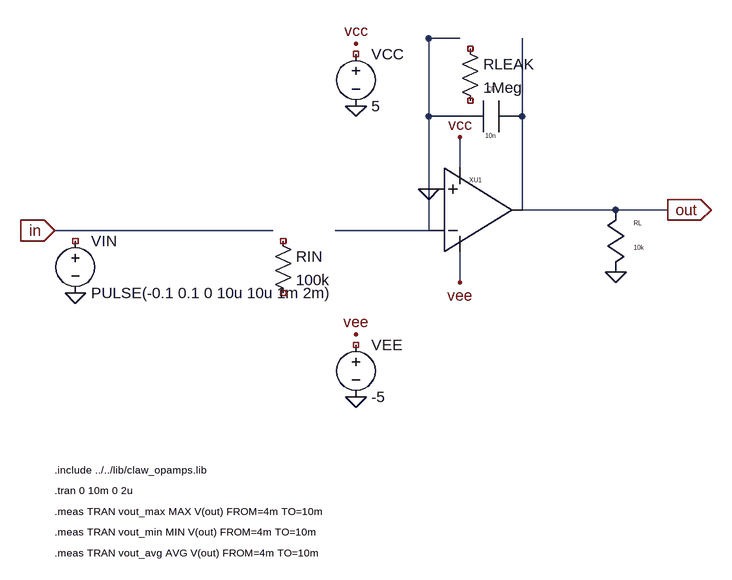
[diagram p0: schematic opamp_practical_integrator.asc]
opamp_practical_integrator.asc, the LTspice schematic file:
Version 4
SHEET 1 1229 1015
WIRE 64 336 400 336
WIRE 496 336 640 336
WIRE 640 336 640 40
WIRE 640 40 688 40
WIRE 640 160 688 160
WIRE 784 40 784 304
WIRE 784 304 1008 304
WIRE 640 160 640 40
WIRE 688 240 688 192
WIRE 688 368 688 416
SYMBOL voltage 96 336 R0
SYMATTR InstName VIN
SYMATTR Value PULSE(-0.1 0.1 0 10u 10u 1m 2m)
SYMBOL voltage 528 48 R0
SYMATTR InstName VCC
SYMATTR Value 5
SYMBOL voltage 528 496 R0
SYMATTR InstName VEE
SYMATTR Value -5
SYMBOL res 400 336 R0
SYMATTR InstName RIN
SYMATTR Value 100k
SYMBOL res 688 40 R0
SYMATTR InstName RLEAK
SYMATTR Value 1Meg
SYMBOL cap_h 688 160 R0
SYMATTR InstName CF
SYMATTR Value 10n
SYMBOL opamp2 640 240 R0
SYMATTR InstName XU1
SYMATTR Value CLAW_IDEAL_OPAMP
SYMBOL res_v 928 304 R0
SYMATTR InstName RL
SYMATTR Value 10k
FLAG 64 336 in
IOPIN 64 336 In
FLAG 1008 304 out
IOPIN 1008 304 Out
FLAG 96 432 0
FLAG 640 272 0
FLAG 928 400 0
FLAG 528 48 vcc
FLAG 528 144 0
FLAG 528 496 vee
FLAG 528 592 0
FLAG 688 192 vcc
FLAG 688 416 vee
TEXT 64 704 Left 1 !.include ../../lib/claw_opamps.lib
TEXT 64 736 Left 1 !.tran 0 10m 0 2u
TEXT 64 768 Left 1 !.meas TRAN vout_max MAX V(out) FROM=4m TO=10m
TEXT 64 800 Left 1 !.meas TRAN vout_min MIN V(out) FROM=4m TO=10m
TEXT 64 832 Left 1 !.meas TRAN vout_avg AVG V(out) FROM=4m TO=10m

The netlist it stands for:
* opamp_practical_integrator.asc
VIN NC_01 0 PULSE(-0.1 0.1 0 10u 10u 1m 2m)
VCC NC_02 0 5
VEE NC_03 0 -5
RIN NC_04 NC_05 100k
RLEAK NC_06 NC_07 1Meg
CF 0 out 10n
XXU1 CLAW_IDEAL_OPAMP CLAW_IDEAL_OPAMP
RL out 0 10k
.include ../../lib/claw_opamps.lib
.tran 0 10m 0 2u
.meas TRAN vout_max MAX V(out) FROM=4m TO=10m
.meas TRAN vout_min MIN V(out) FROM=4m TO=10m
.meas TRAN vout_avg AVG V(out) FROM=4m TO=10m
.backanno
.end